# Altium project netv2mvp-usb3-v1.PrjPcb
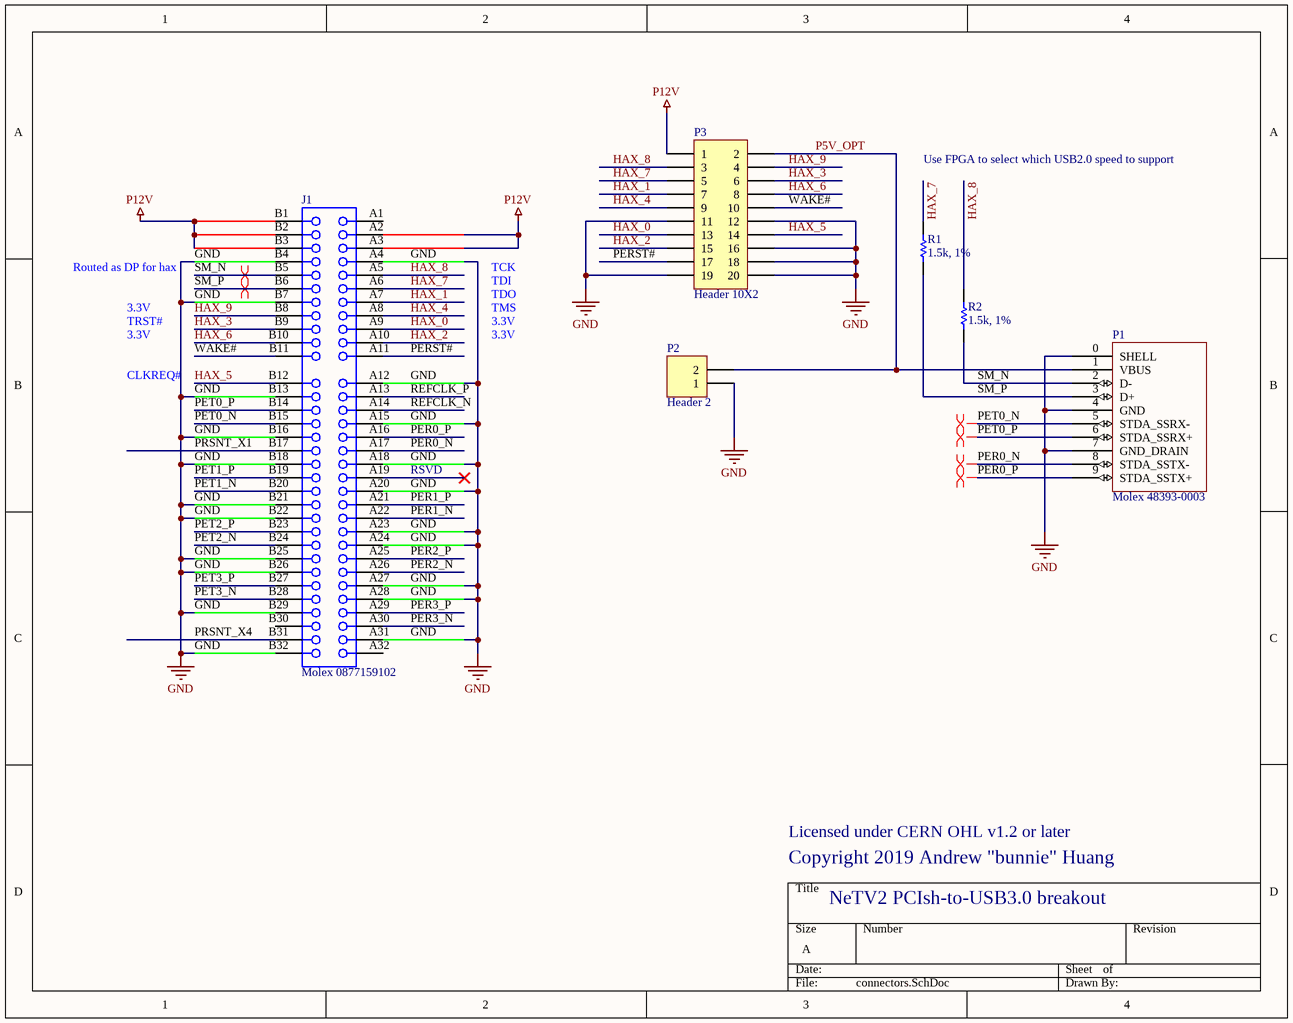
[diagram p0: connectors.SchDoc]
1 sheet, 6 parts. Net scope: global (net labels, ports and power ports of the same name join across sheets).
Board file: netv2mvp-usb3-v1.PcbDoc

## Sheet connectors.SchDoc
size A

### Parts
J1  Molex 0877159102  [BTB1-00-2V64]
P1  Molex 48393-0003  [MOLEX_48393-0003]
P2  Header 2  [HDR1X2]
P3  Header 10X2  [HDR2X10]
R1  1.5k, 1%  [B_RES1206]
R2  1.5k, 1%  [B_RES1206]

### Nets
GND: J1.A4 J1.A12 J1.A15 J1.A18 J1.A20 J1.A23 J1.A24 J1.A27 J1.A28 J1.A31 J1.B4 J1.B7 J1.B13 J1.B16 J1.B18 J1.B21 J1.B22 J1.B25 J1.B26 J1.B29 J1.B32 P1.0(SHELL) P1.4(GND) P1.7(GND_DRAIN) P2.1 P3.11 P3.12 P3.16 P3.18 P3.19 P3.20
P12V: J1.A2 J1.A3 J1.B1 J1.B2 J1.B3 P3.1
HAX_0: J1.A9 P3.13
HAX_1: J1.A7 P3.7
HAX_2: J1.A10 P3.15
HAX_3: J1.B9 P3.6
HAX_4: J1.A8 P3.9
HAX_5: J1.B12 P3.14
HAX_6: J1.B10 P3.8
HAX_7: J1.A6 P3.5 R1.1
HAX_8: J1.A5 P3.3 R2.1
HAX_9: J1.B8 P3.4
P5V_OPT: P1.1(VBUS) P2.2 P3.2
PER0_N: J1.A17 P1.8(STDA_SSTX-)
PER0_P: J1.A16 P1.9(STDA_SSTX+)
PER1_N: J1.A22
PER1_P: J1.A21
PER2_N: J1.A26
PER2_P: J1.A25
PER3_N: J1.A30
PER3_P: J1.A29
PERST#: J1.A11 P3.17
PET0_N: J1.B15 P1.5(STDA_SSRX-)
PET0_P: J1.B14 P1.6(STDA_SSRX+)
PET1_N: J1.B20
PET1_P: J1.B19
PET2_N: J1.B24
PET2_P: J1.B23
PET3_N: J1.B28
PET3_P: J1.B27
PRSNT_X1: J1.B17
PRSNT_X4: J1.B31
REFCLK_N: J1.A14
REFCLK_P: J1.A13
SM_N: J1.B5 P1.2(D-) R2.2
SM_P: J1.B6 P1.3(D+) R1.2
WAKE#: J1.B11 P3.10

Not connected (* = marked no-connect by the designer): J1 A1 A19* A32 B30

### Layout directives
differential pair: PER0_N, PER0_P, PET0_N, PET0_P, SM_N, SM_P

### Notes on the sheet
- Use FPGA to select which USB2.0 speed to support
- Routed as DP for hax
- TDI
- TDO
- TCK
- 3.3V
- TRST#
- TMS
- CLKREQ#
- RSVD
- Licensed under CERN OHL v1.2 or later
- Copyright 2019 Andrew "bunnie" Huang
- NeTV2 PCIsh-to-USB3.0 breakout

### Library data of the parts
J1 = CN-2P-F-J64: Board-to-Board Connector, PTH, Vertical, Pitch 1.00mm, 64-Position; MYPN: J-PCIE-X4; MPN: 0877159102; VENDOR: Molex
P1 = USB_3_TYPE_A: USB 3.0 Normal A Type R/A; MYPN: J-USB3-A-RA; MPN: 48393-0003; VENDOR: Molex
P2 = Header 2: Header, 2-Pin; LatestRevisionDate: 17-Jul-2002; LatestRevisionNote: Re-released for DXP Platform.; Publisher: Altium Limited
P3 = Header 10X2: Header, 10-Pin, Dual row; LatestRevisionDate: 17-Jul-2002; LatestRevisionNote: Re-released for DXP Platform.; Publisher: Altium Limited
R1 R2 = Res1: Resistor; VENDOR: ANY; MYPN: R-152-1P-1_16W-1206; MPN: ANY